# EAGLE design farolasbasura (EAGLE 6.5.0)
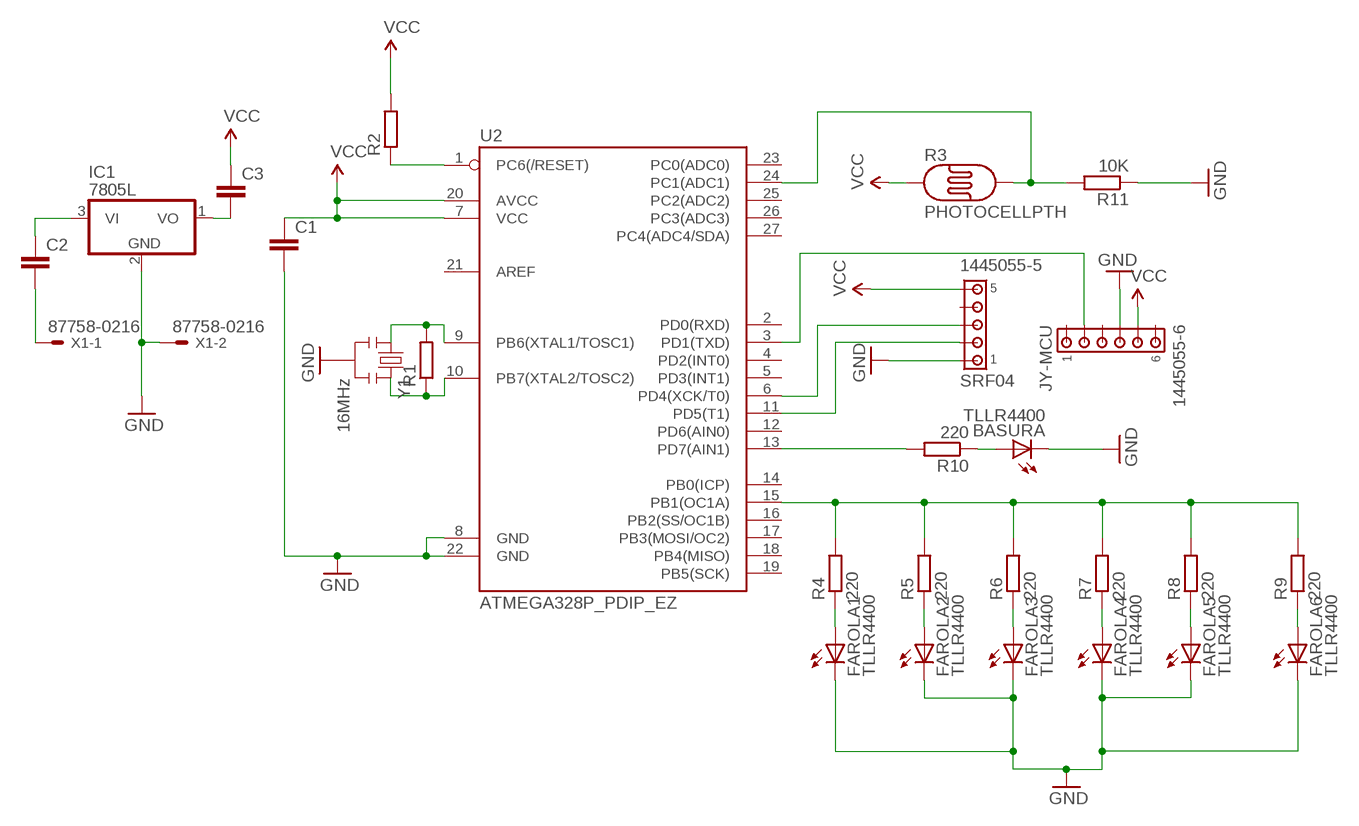
[diagram p0: schematic, sheet 1]

## Parts
BASURA  TLLR4400  [LED3MM]
C1  C-EU050-025X075  [C050-025X075]
C2  C-EU050-025X075  [C050-025X075]
C3  C-EU050-025X075  [C050-025X075]
FAROLA1  TLLR4400  [LED3MM]
FAROLA2  TLLR4400  [LED3MM]
FAROLA3  TLLR4400  [LED3MM]
FAROLA4  TLLR4400  [LED3MM]
FAROLA5  TLLR4400  [LED3MM]
FAROLA6  TLLR4400  [LED3MM]
IC1  7805L  [TO92]
JY-MCU  1445055-6  [1445055-6]
R1  R-EU_0204/7  [0204/7]
R2  R-EU_0204/7  [0204/7]
R3  PHOTOCELLPTH  [PHOTOCELL]
R4  220  R-EU_0204/7  [0204/7]
R5  220  R-EU_0204/7  [0204/7]
R6  220  R-EU_0204/7  [0204/7]
R7  220  R-EU_0204/7  [0204/7]
R8  220  R-EU_0204/7  [0204/7]
R9  220  R-EU_0204/7  [0204/7]
R10  220  R-EU_0204/7  [0204/7]
R11  10K  R-EU_0204/7  [0204/7]
SRF04  1445055-5  [1445055-5]
U2  ATMEGA328P_PDIP_EZ  [DIL28-EZ]
X1  87758-0216  [87758-0216]
Y1  16MHz  RESONATOR16MHZ  [RESONATOR-SMD]

## Nets
GND: BASURA.K(C) C1.2 FAROLA1.K(C) FAROLA2.K(C) FAROLA3.K(C) FAROLA4.K(C) FAROLA5.K(C) FAROLA6.K(C) IC1.2(GND) JY-MCU.4 R11.1 SRF04.1 U2.8(GND) U2.22(GND) X1.2 Y1.2
N$1: R1.2 U2.9(PB6(XTAL1/TOSC1)) Y1.1
N$2: R1.1 U2.10(PB7(XTAL2/TOSC2)) Y1.3
N$3: R2.1 U2.1(PC6(/RESET))
N$4: FAROLA1.A R4.1
N$5: FAROLA2.A R5.1
N$6: C2.1 IC1.3(VI)
N$7: FAROLA3.A R6.1
N$8: FAROLA4.A R7.1
N$9: FAROLA5.A R8.1
N$10: FAROLA6.A R9.1
N$11: BASURA.A R10.1
N$12: R10.2 U2.13(PD7(AIN1))
N$13: R3.2 R11.2 U2.24(PC1(ADC1))
N$14: C2.2 X1.1
N$15: C3.2 IC1.1(VO)
N$16: SRF04.2 U2.11(PD5(T1))
N$17: R4.2 R5.2 R6.2 R7.2 R8.2 R9.2 U2.15(PB1(OC1A))
N$18: SRF04.3 U2.6(PD4(XCK/T0))
N$19: JY-MCU.2 U2.3(PD1(TXD))
VCC: C1.1 C3.1 JY-MCU.5 R2.2 R3.1 SRF04.5 U2.7(VCC) U2.20(AVCC)
Unconnected: JY-MCU.1 JY-MCU.3 JY-MCU.6 SRF04.4 U2.2(PD0(RXD)) U2.4(PD2(INT0)) U2.5(PD3(INT1)) U2.12(PD6(AIN0)) U2.14(PB0(ICP)) U2.16(PB2(SS/OC1B)) U2.17(PB3(MOSI/OC2)) U2.18(PB4(MISO)) U2.19(PB5(SCK)) U2.21(AREF) U2.23(PC0(ADC0)) U2.25(PC2(ADC2)) U2.26(PC3(ADC3)) U2.27(PC4(ADC4/SDA))

## Library data of the parts
BASURA FAROLA1-FAROLA6 = led:TLLR4400: Low Current (2mA) LED 3 mm Tinted Diffused Package color RED Source: Data sheet <http://www.farnell.com/datasheets/391100.pdf>; MF: VISHAY SEMICONDUCTOR; OC_FARNELL: 1612437
C1-C3 = resistor:C-EU: CAPACITOR, European symbol
IC1 = linear:78*: Positive VOLTAGE REGULATOR Source: http://cache.national.com/ds/LM/LM78L05.pdf http://www.fairchildsemi.com/ds/LM/LM7805.pdf
JY-MCU = con-amp:1445055-6: Micro MATE-N-LOK Connectors grid 1.5 mm Source: ENG_CD_1445055_A.pdf
R1 R2 R4-R11 = rcl:R-EU_: RESISTOR, European symbol
R3 = SparkFun-Sensors:PHOTOCELL: CdS photoresistor. This is a low cost way to detect light levels. Resistance decreases with more incoming light. SparkFun SKU: SEN-09088
SRF04 = con-amp:1445055-5: Micro MATE-N-LOK Connectors grid 1.5 mm Source: ENG_CD_1445055_A.pdf
U2 = SparkFun-DigitalIC:ATMEGA328P_PDIP_EZ: uC used in the Arduino 32kb flash, 1k EEPROM, 2k SRAM This is the through-hole version of this chip.
X1 = con-molex:87758-0216: 2 Pin - 2mm Dual Row Single Wafer, Vertical T/H HDR Source: http://www.molex.com/pdm_docs/sd/877580616_sd.pdf; MPN: 87758-0216; OC_FARNELL: unknown; OC_NEWARK: 94M1513
Y1 = SparkFun-FreqCtrl:RESONATOR: Resonator Small SMD resonator. Used, eg, on the Arduino Pro/ Pro Mini boards. 8MHz- XTAL-08895 16MHz- XTAL-08900; PROD_ID: XTAL-08900

## Board
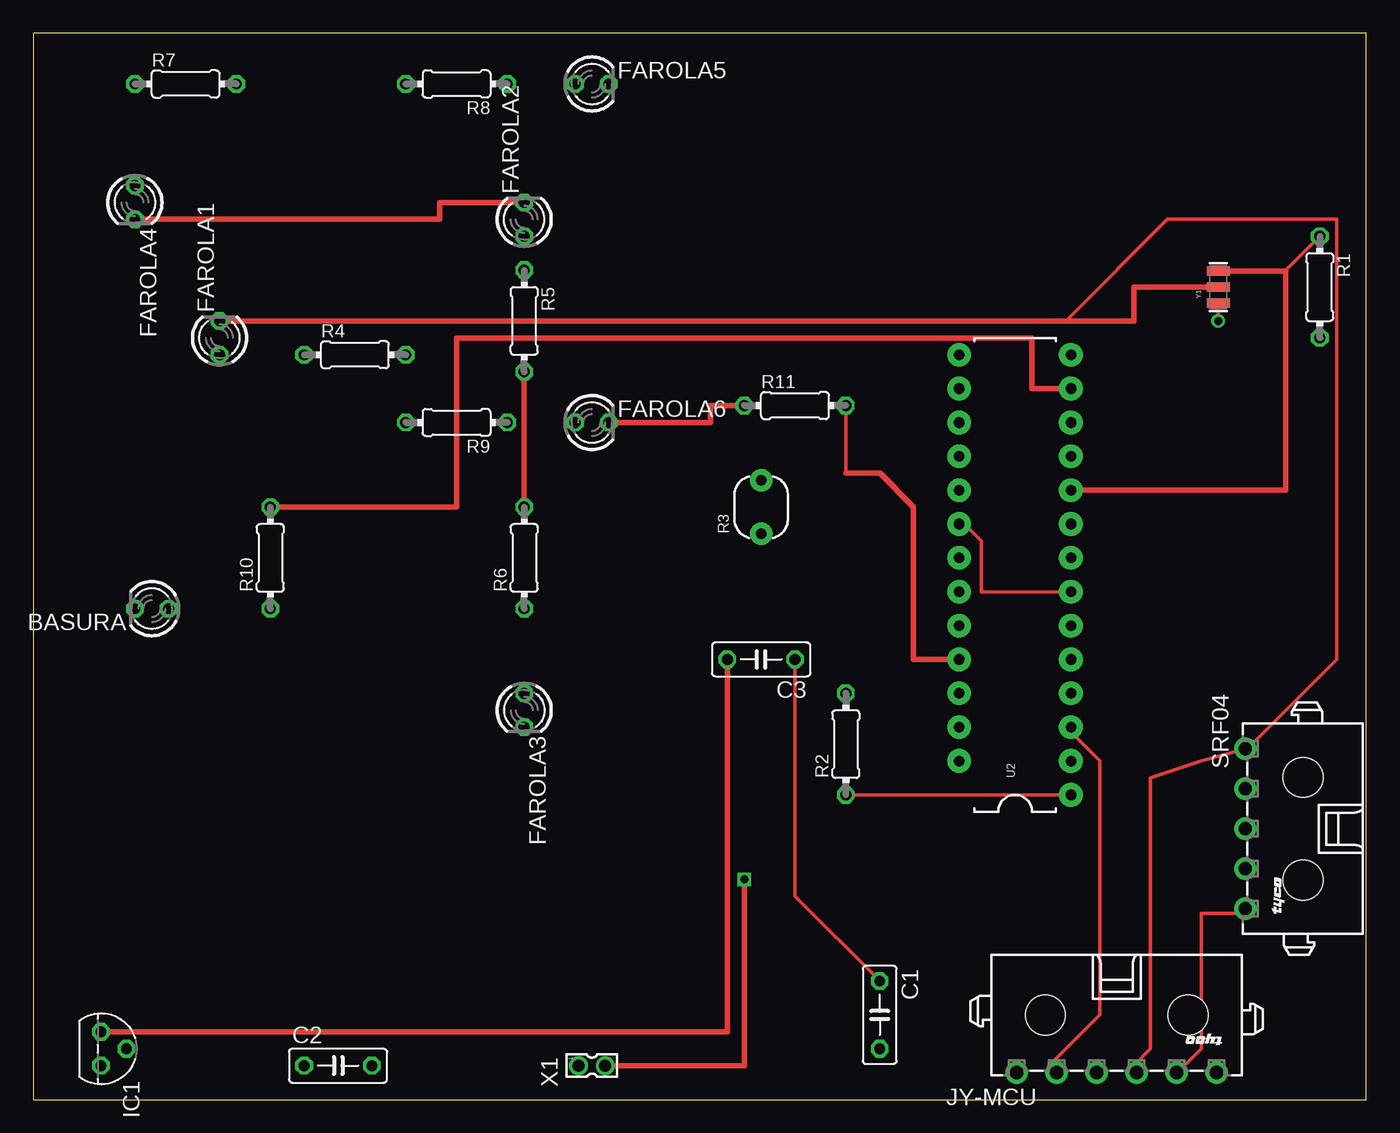
[diagram p1: board, top side]
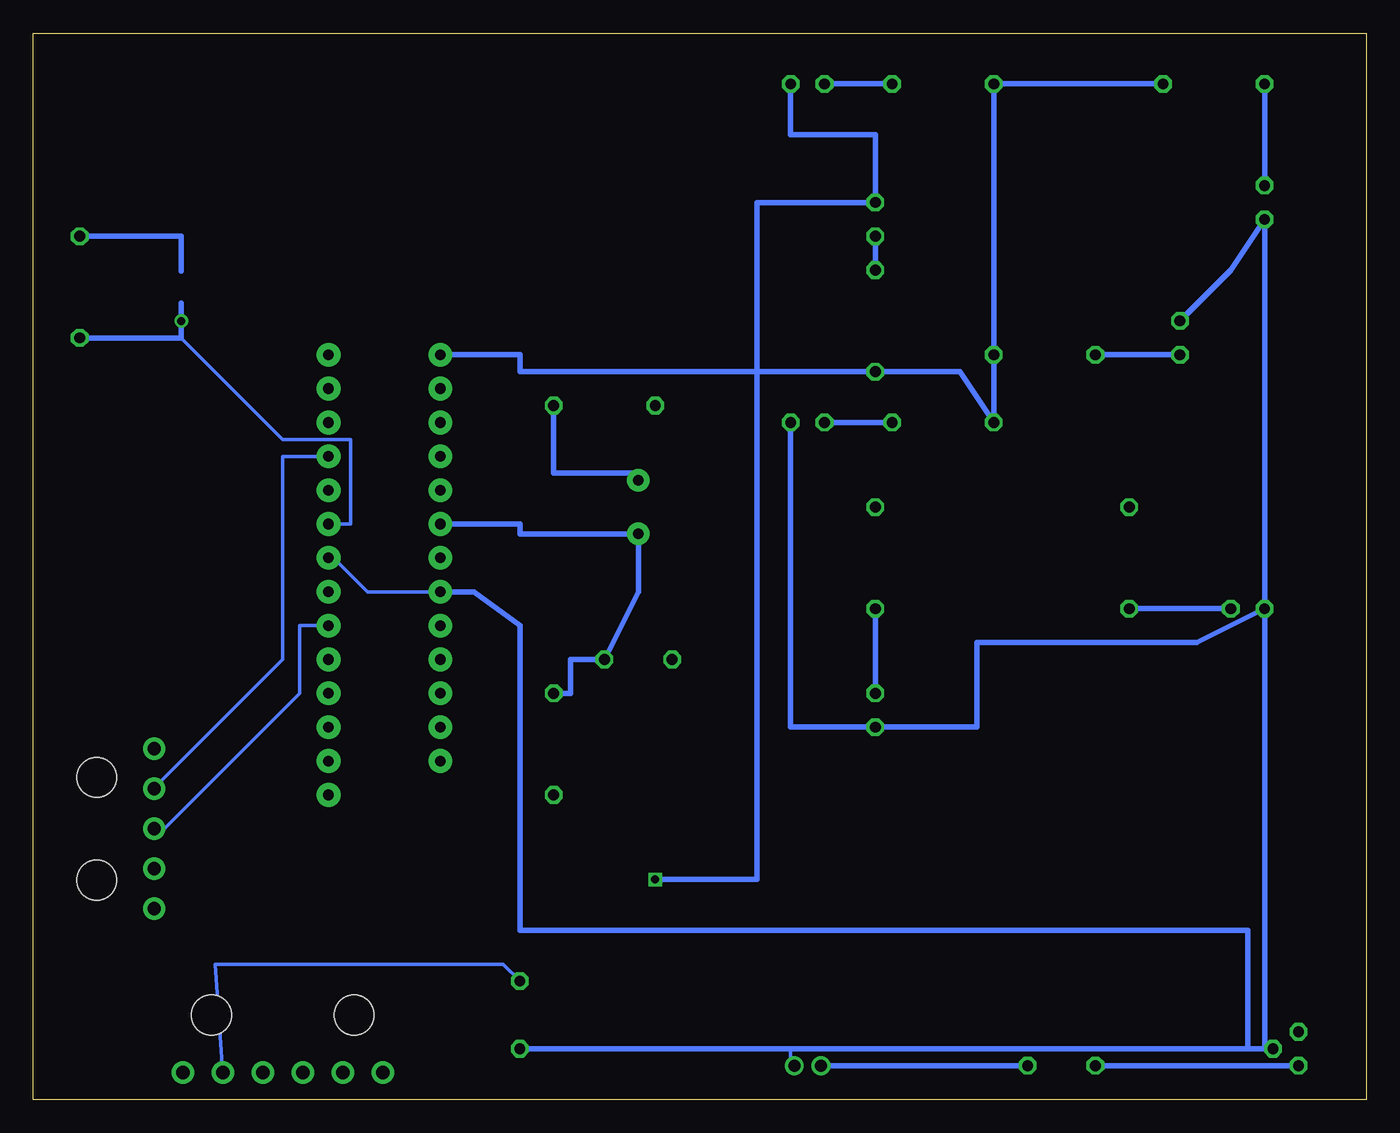
[diagram p2: board, bottom side, seen from below]

Size 100 x 80 mm. Coordinates in mm from the lower left corner, seen from the top.
Outline: 0,0 100,0 100,80 0,80 0,0
Copper layers (1*16): Top 0.035mm / dielectric 1.5mm / Bottom 0.035mm
Design rules "default": minimum track width 10mil, minimum drill 24mil, track to track 8mil, track to pad 8mil, pad to pad 8mil, via to via 8mil, smd to smd 8mil, copper to edge 40mil, drill to drill 8mil, minimum pad ring 10mil, minimum via ring 8mil, stop-mask expansion 4mil, vias tented up to drill 0mil, thermal gap 10mil

### Footprints (pad centres in the part's own frame; a part is rotated, then mirrored left to right if it is on the bottom)
LED3MM = drill 0.813 octagon: A -1.27,0; K 1.27,0
C050-025X075 = drill 0.813 octagon: 1 -2.54,0; 2 2.54,0
TO92 = drill 0.813 octagon: 1 -1.27,0; 2 0,1.905; 3 1.27,0
1445055-6 = drill 1 pad 1.676: 1 7.5,4.32; 2 4.5,4.32; 3 1.5,4.32; 4 -1.5,4.32; 5 -4.5,4.32; 6 -7.5,4.32 | hole 3: -5.35,0; 5.35,0
0204/7 = drill 0.813 octagon: 1 -3.81,0; 2 3.81,0
PHOTOCELL = drill 0.8 pad 1.676: 1 -2,0; 2 2,0
1445055-5 = drill 1 pad 1.676: 1 6,4.32; 2 3,4.32; 3 0,4.32; 4 -3,4.32; 5 -6,4.32 | hole 3: -3.85,0; 3.85,0
DIL28-EZ = drill 0.8 pad 1.778: 1 -16.51,-4.191; 2 -13.97,-4.191; 3 -11.43,-4.191; 4 -8.89,-4.191; 5 -6.35,-4.191; 6 -3.81,-4.191; 7 -1.27,-4.191; 8 1.27,-4.191; 9 3.81,-4.191; 10 6.35,-4.191; 11 8.89,-4.191; 12 11.43,-4.191; 13 13.97,-4.191; 14 16.51,-4.191; 15 16.51,4.191; 16 13.97,4.191; 17 11.43,4.191; 18 8.89,4.191; 19 6.35,4.191; 20 3.81,4.191; 21 1.27,4.191; 22 -1.27,4.191; 23 -3.81,4.191; 24 -6.35,4.191; 25 -8.89,4.191; 26 -11.43,4.191; 27 -13.97,4.191
87758-0216 = drill 0.9 pad 1.27: 1 0,-1; 2 0,1
RESONATOR-SMD = smd 0.7 x 1.7: 1 -1.2,0; 2 0,0; 3 1.2,0

### Placement (x,y rotation side)
BASURA  8.89,36.83 180 top
C1  63.5,6.35 270 top
C2  22.86,2.54 0 top
C3  54.61,33.02 180 top
FAROLA1  13.97,57.15 90 top
FAROLA2  36.83,66.04 90 top
FAROLA3  36.83,29.21 270 top
FAROLA4  7.62,67.31 270 top
FAROLA5  41.91,76.2 0 top
FAROLA6  41.91,50.8 0 top
IC1  5.08,3.81 270 top
JY-MCU  81.28,6.35 180 top
R1  96.52,60.96 270 top
R2  60.96,26.67 90 top
R3  54.61,44.45 90 top
R4  24.13,55.88 0 top
R5  36.83,58.42 270 top
R6  36.83,40.64 90 top
R7  11.43,76.2 0 top
R8  31.75,76.2 180 top
R9  31.75,50.8 180 top
R10  17.78,40.64 90 top
R11  57.15,52.07 0 top
SRF04  95.25,20.32 90 top
U2  73.66,39.37 90 top
X1  41.91,2.54 270 top
Y1  88.9,60.96 90 top

### Tracks (layer width: path | path; a pad name or v marks a point on that pad's centre or on a via)
GND
  Top 0.254: JY-MCU.4 82.55,2.54 83.82,3.81 83.82,24.13 87.63,25.4 SRF04.1 91.44,26.67 97.79,33.02 97.79,66.04 85.09,66.04 77.47,58.42
  Top 0.406: FAROLA4.K 30.48,66.04 30.48,67.31 FAROLA2.K | X1.2 53.34,2.54 53.34,16.51 | FAROLA6.K 50.8,50.8 50.8,52.07 R11.1 | FAROLA1.K 77.47,58.42 82.55,58.42 82.55,60.96 Y1.2
  Bottom 0.254: U2.22 74.93,38.1 77.47,40.64 U2.8 | 43.18,3.81 43.18,2.54 X1.2
  Bottom 0.406: C1.2 43.18,3.81 IC1.2 | FAROLA5.K 43.18,72.39 36.83,72.39 FAROLA2.K 45.72,67.31 45.72,16.51 53.34,16.51 | FAROLA1.K 10.16,62.23 FAROLA4.K BASURA.K | BASURA.K 12.7,34.29 29.21,34.29 29.21,27.94 FAROLA3.K 43.18,27.94 FAROLA6.K | IC1.2 7.62,3.81 BASURA.K | IC1.2 8.89,3.81 8.89,12.7 63.5,12.7 63.5,35.56 66.93,38.1 U2.22
N$1  (via drill 0.61)
  Top 0.254: v88.9,58.42 Y1.1
  Bottom 0.254: 88.9,57.15 81.28,49.53 76.2,49.53 76.2,43.18 U2.9
  Bottom 0.406: R1.2 88.9,57.15 v88.9,58.42 Y1.1
N$2
  Top 0.254: R1.1 93.98,62.23 93.98,62.16
  Top 0.406: Y1.3 93.98,62.16 93.98,45.72 U2.10
  Bottom 0.406: R1.1 88.9,64.77 Y1.3
N$3
  Top 0.254: U2.1 R2.1
N$4
  Bottom 0.406: FAROLA1.A R4.1
N$5
  Bottom 0.406: R5.1 FAROLA2.A
N$6
  Bottom 0.406: IC1.3 C2.1
N$7
  Bottom 0.406: R6.1 FAROLA3.A
N$8
  Bottom 0.406: R7.1 FAROLA4.A
N$9
  Bottom 0.406: R8.1 FAROLA5.A
N$10
  Bottom 0.406: FAROLA6.A R9.1
N$11
  Bottom 0.406: R10.1 BASURA.A
N$12
  Top 0.406: R10.2 31.75,44.45 31.75,57.15 74.93,57.15 74.93,53.34 U2.13
N$13
  Top 0.254: 60.96,46.99 R11.2
  Top 0.406: U2.24 66.04,33.02 66.04,44.45 63.5,46.99 60.96,46.99
  Bottom 0.406: R11.2 60.96,46.99 54.61,46.99 R3.2
N$14
  Bottom 0.406: C2.2 X1.1
N$15
  Top 0.406: IC1.1 52.07,5.08 C3.2
N$16
  Bottom 0.254: SRF04.2 91.44,22.86 81.28,33.02 81.28,48.26 U2.11 77.47,48.26
N$17
  Top 0.406: R5.2 R6.2
  Bottom 0.406: R7.2 R8.2 R4.2 R9.2 30.48,54.61 R5.2 63.5,54.61 63.5,55.88 U2.15
N$18
  Bottom 0.254: SRF04.3 90.17,20.32 80.01,30.48 80.01,35.56 U2.6 77.47,35.56
N$19
  Top 0.254: JY-MCU.2 76.2,2.54 80.01,6.35 80.01,25.4 77.47,27.94 U2.3
N$20  (via drill 0.6)
  other vias: 53.34,16.51
VCC
  Top 0.254: JY-MCU.5 86.36,2.54 87.63,3.81 87.63,13.97 90.17,13.97 SRF04.5 | C1.1 57.15,15.24 C3.1 | U2.7 71.12,38.1 71.12,41.91 69.85,43.18 U2.20
  Bottom 0.254: C1.1 64.77,10.16 86.36,10.16 JY-MCU.5
  Bottom 0.406: R2.2 59.69,30.48 59.69,33.02 C3.1 54.61,38.1 R3.1 63.5,42.45 63.5,43.18 U2.20